# EAGLE design Convertisseur_BusCAN_vers_serial_TTL_TNN_V1.0 (EAGLE 9.6.2)
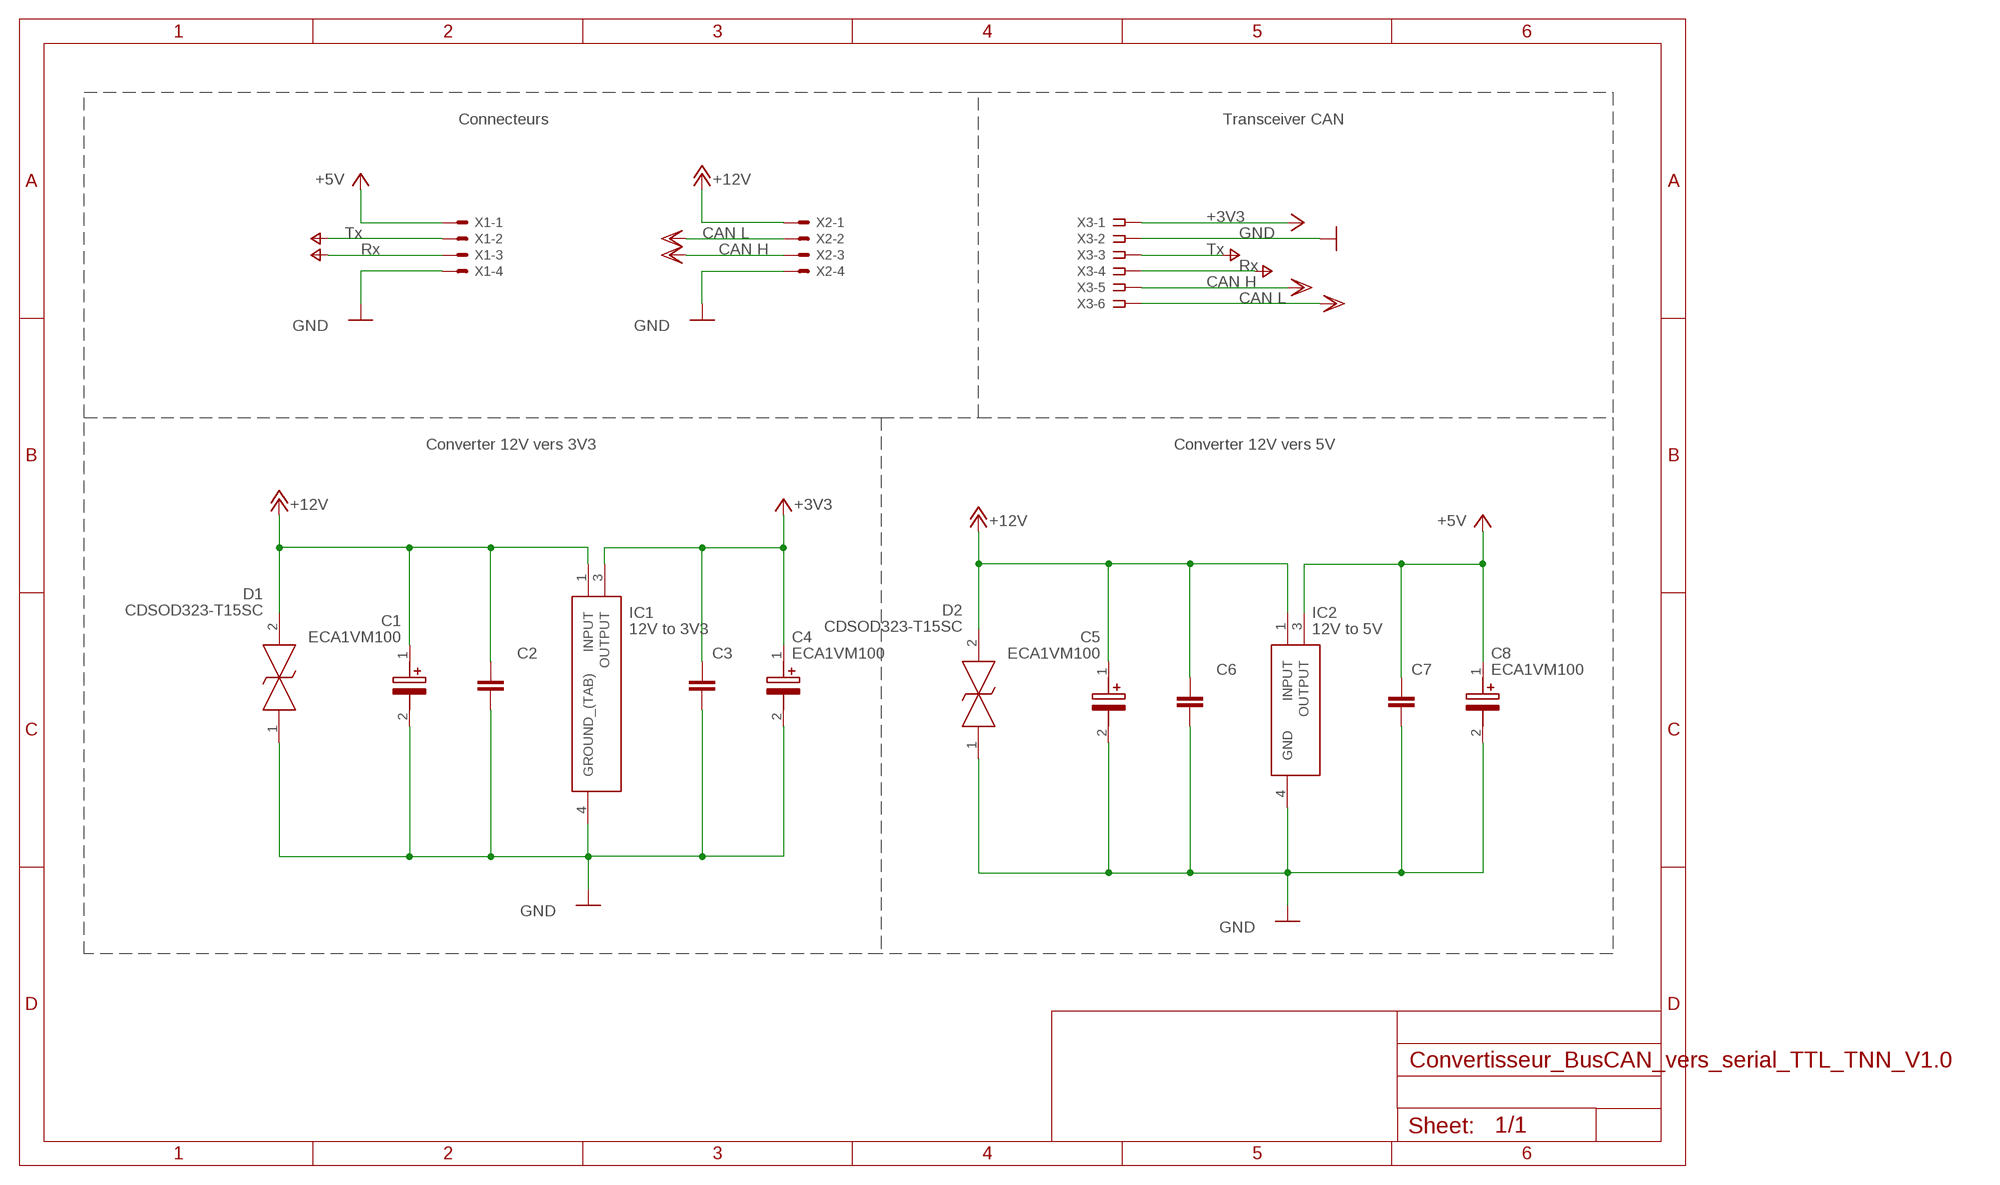
[diagram p0: schematic, sheet 1]

## Parts
C1  ECA1VM100  [CAPPRD200W55D525H1200]
C2  C-EUC0603  [C0603]
C3  C-EUC0603  [C0603]
C4  ECA1VM100  [CAPPRD200W55D525H1200]
C5  ECA1VM100  [CAPPRD200W55D525H1200]
C6  C-EUC0603  [C0603]
C7  C-EUC0603  [C0603]
C8  ECA1VM100  [CAPPRD200W55D525H1200]
D1  CDSOD323-T15SC  [SOD-323]
D2  CDSOD323-T15SC  [SOD-323]
IC1  12V to 3V3  LF33ABDT-TR  [TO228P972X240-3N]
IC2  12V to 5V  L4941BDT-TR  [TO228P972X240-3N]
X1  KK-156-4  [KK-156-4]
X2  KK-156-4  [KK-156-4]
X3  SSW-106-02-G-S  [SSW-106-02-G-S]

## Nets
+3V3: C3.1 C4.1(+) IC1.3(OUTPUT) X3.1
+5V: C7.1 C8.1(+) IC2.3(OUTPUT) X1.1
+12V: C1.1(+) C2.1 C5.1(+) C6.1 D1.2 D2.2 IC1.1(INPUT) IC2.1(INPUT) X2.1
CANH: X2.3 X3.5 ; supply symbol labelled CAN H
CANL: X2.2 X3.6 ; supply symbol labelled CAN L
GND: C1.2(-) C2.2 C3.2 C4.2(-) C5.2(-) C6.2 C7.2 C8.2(-) D1.1 D2.1 IC1.4(GROUND_(TAB)) IC2.4(GND) X1.4 X2.4 X3.2
RX: X1.3 X3.4 ; supply symbol labelled Rx
TX: X1.2 X3.3 ; supply symbol labelled Tx

## Notes on the sheet
- Connecteurs | Transceiver CAN
- Converter 12V vers 3V3 | Converter 12V vers 5V

## Library data of the parts
C1 C4 C5 C8 = ECA1VM100:ECA1VM100: M radial Al elect cap,10uF 35V 85deg C Panasonic 10uF 35 V dc Aluminium Electrolytic Capacitor, M Series 2000h Source: Datasheet <http://industrial.panasonic.com/cdbs/www-data/pdf/RDF0000/ABA0000C1218.pdf>; DESCRIPTION: M radial Al elect cap,10uF 35V 85deg C Panasonic 10uF 35 V dc Aluminium Electrolytic Capacitor, M Series 2000h; HEIGHT: 12mm; MANUFACTURER_NAME: Panasonic; MANUFACTURER_PART_NUMBER: ECA1VM100
C2 C3 C6 C7 = rcl:C-EU: CAPACITOR, European symbol; SPICEPREFIX: C
D1 D2 = CDSOD323-T15SC:CDSOD323-T15SC: TVS Diode ESD 15V BiDirectional SOD323 Bourns CDSOD323-T15SC Bi-Directional TVS Diode, 400W peak, 2-Pin SOD-323 Source: Datasheet <https://datasheet.datasheetarchive.com/originals/distributors/Datasheets-DGA26/1841678.pdf>; ARROW_PART_NUMBER: CDSOD323-T15SC; ARROW_PRICE-STOCK: https://www.arrow.com/en/products/cdsod323-t15sc/bourns?region=nac; DESCRIPTION: TVS Diode ESD 15V BiDirectional SOD323 Bourns CDSOD323-T15SC Bi-Directional TVS Diode, 400W peak, 2-Pin SOD-323; HEIGHT: mm; MANUFACTURER_NAME: Bourns; MANUFACTURER_PART_NUMBER: CDSOD323-T15SC; MOUSER_PART_NUMBER: 652-CDSOD323-T15SC; MOUSER_PRICE-STOCK: https://www.mouser.co.uk/ProductDetail/Bourns/CDSOD323-T15SC?qs=6S5Watp5UnLvz%2FtnS7XuhA%3D%3D
IC1 = LF33ABDT-TR:LF33ABDT-TR: LF33ABDT-TR, Low Dropout Voltage Regulator, 0.5A, 3.3 V +/-1%, 3-Pin DPAK Source: Datasheet <http://www.st.com/web/en/resource/technical/document/datasheet/CD00000546.pdf>; ARROW_PART_NUMBER: LF33ABDT-TR; ARROW_PRICE-STOCK: https://www.arrow.com/en/products/lf33abdt-tr/stmicroelectronics?region=nac; DESCRIPTION: LF33ABDT-TR, Low Dropout Voltage Regulator, 0.5A, 3.3 V +/-1%, 3-Pin DPAK; HEIGHT: 2.4mm; MANUFACTURER_NAME: STMicroelectronics; MANUFACTURER_PART_NUMBER: LF33ABDT-TR; MOUSER_PART_NUMBER: 511-LF33ABDT-TR; MOUSER_PRICE-STOCK: https://www.mouser.co.uk/ProductDetail/STMicroelectronics/LF33ABDT-TR?qs=X0YN45AWjTaYMp6aKKXn6w%3D%3D
IC2 = L4941BDT-TR:L4941BDT-TR: L4941BDT-TR, Low Dropout Voltage Regulator, 1A, 5 V +/-4%, 3-Pin DPAK Source: Datasheet <http://www.st.com/web/en/resource/technical/document/datasheet/CD00000443.pdf>; ARROW_PART_NUMBER: L4941BDT-TR; ARROW_PRICE-STOCK: https://www.arrow.com/en/products/l4941bdt-tr/stmicroelectronics?region=nac; DESCRIPTION: L4941BDT-TR, Low Dropout Voltage Regulator, 1A, 5 V +/-4%, 3-Pin DPAK; HEIGHT: 2.4mm; MANUFACTURER_NAME: STMicroelectronics; MANUFACTURER_PART_NUMBER: L4941BDT-TR; MOUSER_PART_NUMBER: 511-L4941BDT-TR; MOUSER_PRICE-STOCK: https://www.mouser.co.uk/ProductDetail/STMicroelectronics/L4941BDT-TR?qs=tPFdqECvbMIySYN92F2N4Q%3D%3D
X1 X2 = con-molex:KK-156-4: KK 156 HEADER Source: http://www.molex.com/pdm_docs/sd/026604100_sd.pdf; MF: MOLEX; OC_FARNELL: unknown; OC_NEWARK: unknown
X3 = con-samtec:SSW-106-02-G-S: THROUGH-HOLE .025" SQ POST SOCKET Source: Samtec SSW.pdf; MF: Samtec Inc.; MPN: SSW-106-02-G-S; OC_FARNELL: unknown; OC_NEWARK: 11P9416

## Board
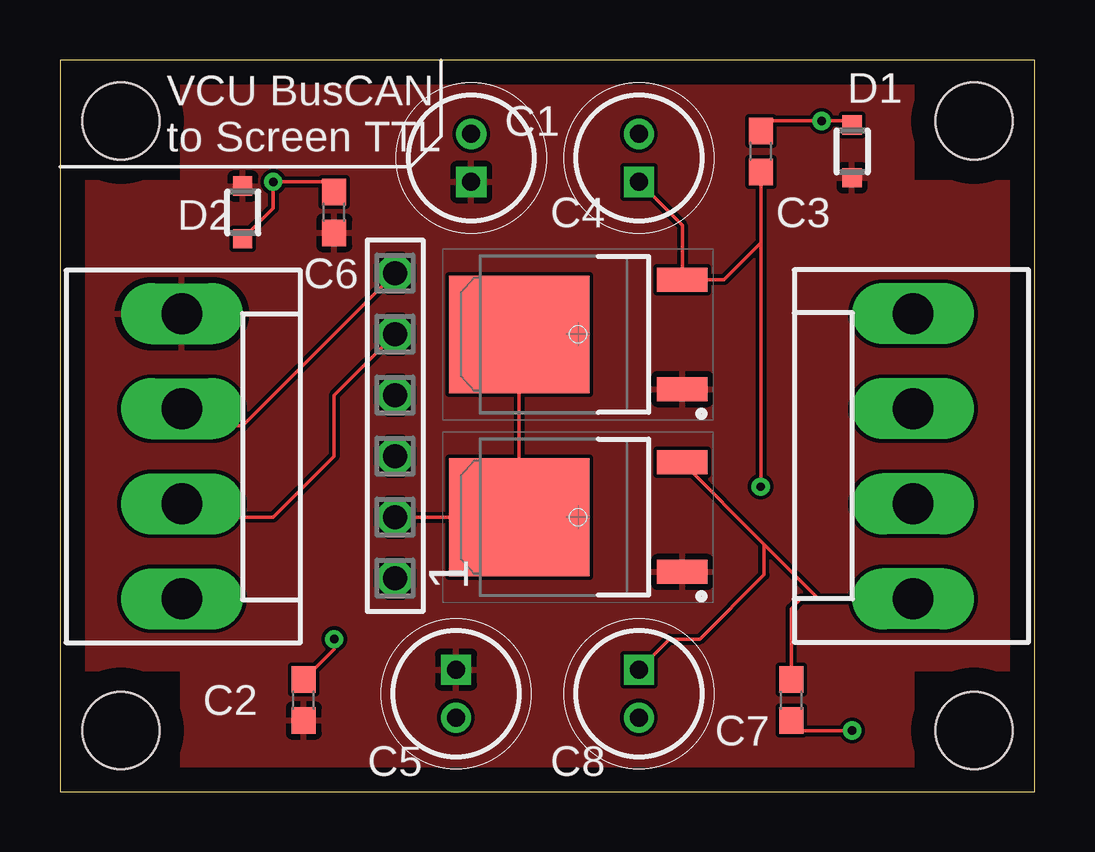
[diagram p1: board, top side]
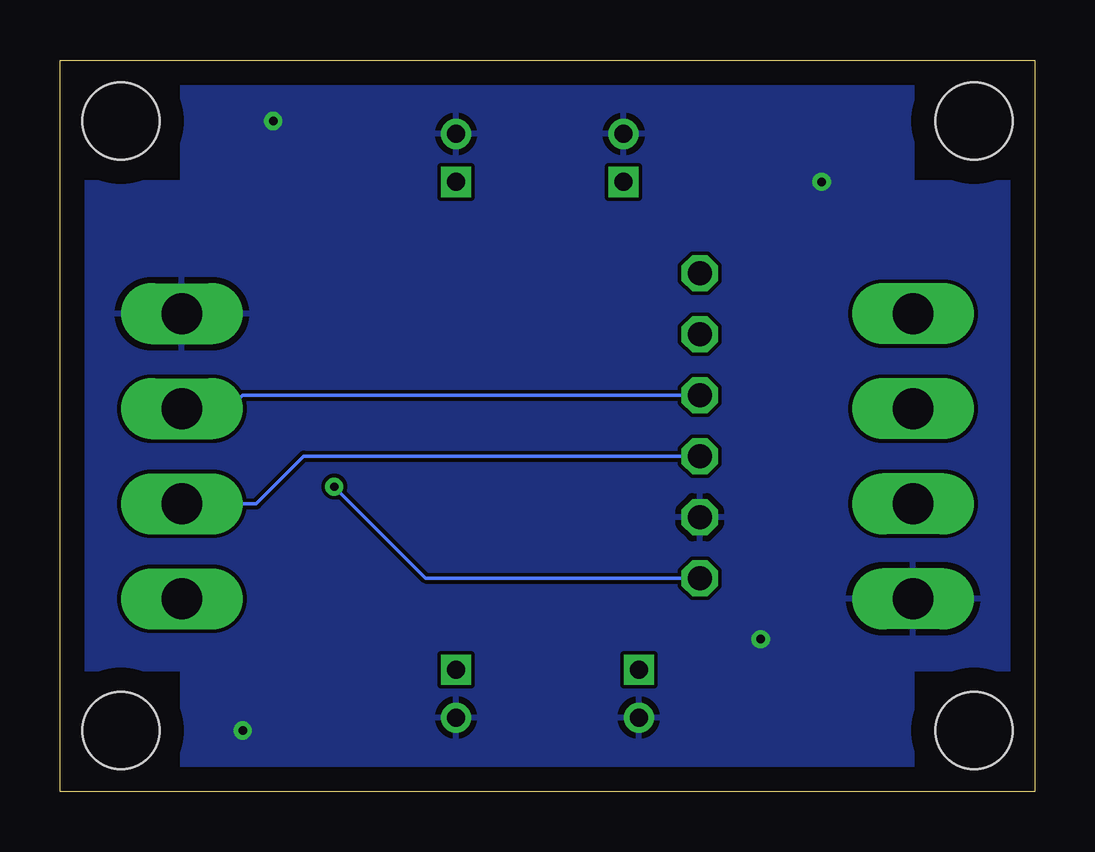
[diagram p2: board, bottom side, seen from below]

Size 40.64 x 30.48 mm. Coordinates in mm from the lower left corner, seen from the top.
Outline: 0,30.48 0,0 40.64,0 40.64,30.48 0,30.48
Copper layers (1*16): Top 0.035mm / dielectric 1.5mm / Bottom 0.035mm
Design rules "default": minimum track width 6mil, minimum drill 0.35mm, track to track 6mil, track to pad 6mil, pad to pad 6mil, via to via 6mil, smd to smd 6mil, copper to edge 40mil, drill to drill 6mil, minimum pad ring 10mil, minimum via ring 8mil, stop-mask expansion 4mil, vias tented up to drill 0mil, thermal gap 10mil
Holes 3.2 mm at 2.54,27.94 38.1,27.94 38.1,2.54 2.54,2.54

### Footprints (pad centres in the part's own frame; a part is rotated, then mirrored left to right if it is on the bottom)
CAPPRD200W55D525H1200 = drill 0.75 pad 1.15 square: 1 0,0 | drill 0.75 pad 1.15: 2 2,0
C0603 = smd 1.1 x 1: 1 -0.85,0; 2 0.85,0
SOD-323 = smd 0.8 x 0.8: 1 -1.1,0; 2 1.1,0
TO228P972X240-3N = smd 2.1 x 1: 1 -4.35,2.28; 3 -4.35,-2.28 | smd 5.85 x 4.9: 4 2.45,0
KK-156-4 = drill 1.7 pad 2.184 long: 1 -5.94,0; 2 -1.98,0; 3 1.98,0; 4 5.94,0
SSW-106-02-G-S = drill 1 pad 1.5 octagon: 1 -6.35,0; 2 -3.81,0; 3 -1.27,0; 4 1.27,0; 5 3.81,0; 6 6.35,0

### Placement (x,y rotation side)
C1  17.14,25.4 90 top
C2  10.16,3.81 90 top
C3  29.21,26.67 90 top
C4  24.13,25.4 90 top
C5  16.51,5.08 270 top
C6  11.43,24.13 90 top
C7  30.48,3.81 270 top
C8  24.13,5.08 270 top
D1  33.02,26.67 270 top
D2  7.62,24.13 90 top
IC1  21.59,19.05 180 top
IC2  21.59,11.43 180 top
X1  35.56,13.97 90 top
X2  5.08,13.97 270 top
X3  13.97,15.24 90 top

### Tracks (layer width: path | path; a pad name or v marks a point on that pad's centre or on a via)
+3V3  (via drill 0.35)
  Top 0.152: C4.1 25.94,23.59 IC1.3 27.68,21.33 29.21,22.86 | C3.1 29.21,22.86 | 29.21,22.86 v29.21,12.7
  Bottom 0.152: v29.21,12.7 25.4,8.89 X3.1
+5V
  Top 0.152: IC2.3 29.35,10.3 | 29.35,10.3 31.62,8.03 | 31.62,8.03 31.75,8.03 X1.1 | C8.1 25.4,6.35 26.67,6.35 29.35,9.03 29.35,10.3 | C7.1 30.48,7.62 30.89,8.03 31.62,8.03
+12V
  pour Top: 5.08,25.4 0,25.4 0,5.08 5.08,5.08 5.08,0 35.56,0 35.56,5.08 40.64,5.08 40.64,25.4 35.56,25.4 35.56,30.48 5.08,30.48
CANH
  Top 0.152: X3.5 11.43,16.51 11.43,13.97 8.89,11.43 5.64,11.43 X2.3
CANL
  Top 0.152: X2.2 5.79,15.24 7.62,15.24 X3.6
GND  (via drill 0.35)
  Top 0.152: X3.2 IC2.4 IC1.4 | C3.2 29.63,27.94 v31.75,27.94 33.02,27.94 D1.1 | D2.1 8.89,24.3 v8.89,25.4 11.01,25.4 C6.2 | C2.2 11.43,5.93 v11.43,6.35 | C7.2 30.9,2.54 v33.02,2.54
  pour Bottom: 0,25.4 0,5.08 5.08,5.08 5.08,0 35.56,0 35.56,5.08 40.64,5.08 40.64,25.4 35.56,25.4 35.56,30.48 5.08,30.48 5.08,25.4
RX
  Bottom 0.152: X1.3 33.58,15.95 33.02,16.51 X3.4
TX
  Bottom 0.152: X1.2 32.46,11.99 30.48,13.97 X3.3

### Text on the board
tNames: VCU BusCAN / to Screen TTL